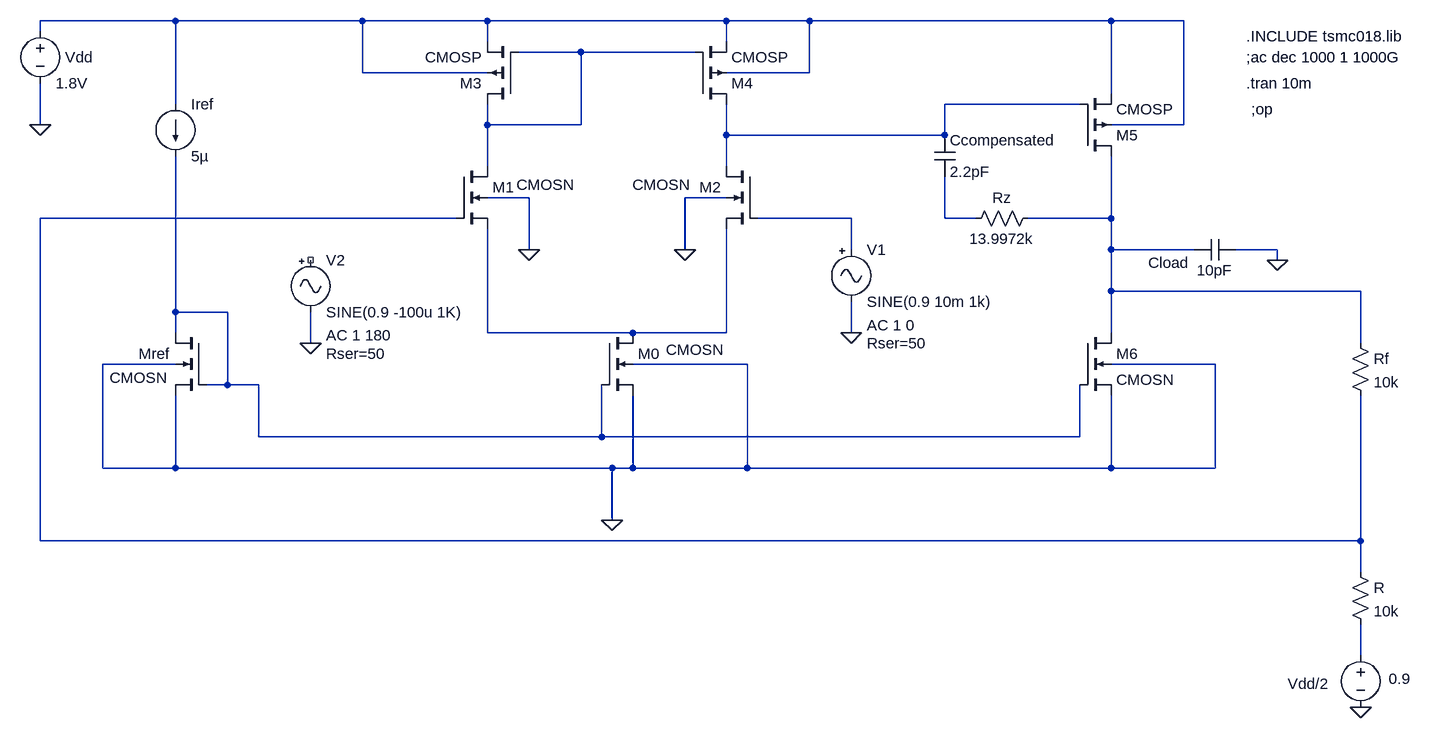
[diagram p0: schematic 2_STAGE_OTA_CLOSED_LOOP_ADITYATRIVED.asc]
2_STAGE_OTA_CLOSED_LOOP_ADITYATRIVED.asc, the LTspice schematic file:
Version 4
SHEET 1 1724 804
WIRE -416 -288 -624 -288
WIRE -128 -288 -416 -288
WIRE 64 -288 -128 -288
WIRE 432 -288 64 -288
WIRE 560 -288 432 -288
WIRE 1024 -288 560 -288
WIRE 1136 -288 1024 -288
WIRE -624 -272 -624 -288
WIRE 64 -256 64 -288
WIRE 432 -256 432 -288
WIRE 208 -240 112 -240
WIRE 384 -240 208 -240
WIRE -128 -208 -128 -288
WIRE 64 -208 -128 -208
WIRE 560 -208 560 -288
WIRE 560 -208 432 -208
WIRE 1024 -176 1024 -288
WIRE -416 -160 -416 -288
WIRE 928 -160 768 -160
WIRE 976 -160 928 -160
WIRE -624 -128 -624 -192
WIRE 64 -128 64 -160
WIRE 208 -128 208 -240
WIRE 208 -128 64 -128
WIRE 1136 -128 1136 -288
WIRE 1136 -128 1024 -128
WIRE 432 -112 432 -160
WIRE 768 -112 768 -160
WIRE 768 -112 432 -112
WIRE 64 -64 64 -128
WIRE 432 -64 432 -112
WIRE 128 -16 64 -16
WIRE 432 -16 368 -16
WIRE 1024 -16 1024 -80
WIRE -80 16 -624 16
WIRE 16 16 -80 16
WIRE 624 16 480 16
WIRE 768 16 768 -48
WIRE 816 16 768 16
WIRE 1024 16 1024 -16
WIRE 1024 16 896 16
WIRE 128 64 128 -16
WIRE 368 64 368 -16
WIRE 624 64 624 16
WIRE 1024 64 1024 16
WIRE 1152 64 1024 64
WIRE 1280 64 1216 64
WIRE 1280 80 1280 64
WIRE -416 112 -416 -80
WIRE 1024 128 1024 64
WIRE 1408 128 1024 128
WIRE -416 160 -416 112
WIRE -336 160 -416 160
WIRE -416 192 -416 160
WIRE 64 192 64 32
WIRE 240 192 64 192
WIRE 288 192 240 192
WIRE 432 192 432 32
WIRE 432 192 288 192
WIRE 624 192 624 144
WIRE 1024 192 1024 128
WIRE -208 208 -208 160
WIRE 1408 208 1408 128
WIRE -416 240 -528 240
WIRE 464 240 288 240
WIRE 1184 240 1024 240
WIRE -336 272 -336 160
WIRE -336 272 -368 272
WIRE -288 272 -336 272
WIRE -288 352 -288 272
WIRE 160 352 -288 352
WIRE 240 352 240 272
WIRE 240 352 160 352
WIRE 912 352 240 352
WIRE 976 352 976 272
WIRE 976 352 912 352
WIRE -528 400 -528 240
WIRE -416 400 -416 288
WIRE -416 400 -528 400
WIRE 256 400 -416 400
WIRE 288 400 288 288
WIRE 288 400 256 400
WIRE 464 400 464 240
WIRE 464 400 288 400
WIRE 1024 400 1024 288
WIRE 1024 400 464 400
WIRE 1184 400 1184 240
WIRE 1184 400 1024 400
WIRE 256 480 256 400
WIRE -624 512 -624 16
WIRE 1408 512 1408 288
WIRE 1408 512 -624 512
WIRE 1408 560 1408 512
WIRE 1408 688 1408 640
FLAG 256 480 0
FLAG -624 -128 0
FLAG 128 64 0
FLAG 368 64 0
FLAG 1408 768 0
FLAG 624 192 0
FLAG -208 208 0
FLAG 1280 80 0
DATAFLAG 432 -112 ""
DATAFLAG 240 192 ""
DATAFLAG 208 -240 ""
DATAFLAG 928 -160 ""
DATAFLAG 912 352 ""
DATAFLAG 160 352 ""
DATAFLAG -416 112 ""
DATAFLAG -80 16 ""
DATAFLAG 64 -128 ""
DATAFLAG 1024 -16 ""
SYMBOL cmosn 240 192 R0
WINDOW 3 99 26 Left 2
SYMATTR InstName M0
SYMATTR Value2 l=1u w=8.5u
SYMBOL cmosn 16 -64 R0
WINDOW 3 93 28 Left 2
SYMATTR InstName M1
SYMATTR Value2 l=1u w=9u
SYMBOL cmosp 112 -160 R180
SYMATTR InstName M3
SYMATTR Value2 l=1u w=1.12u
SYMBOL cmosn 480 -64 M0
WINDOW 3 103 28 Left 2
SYMATTR InstName M2
SYMATTR Value2 l=1u w=9u
SYMBOL cmosp 384 -160 M180
SYMATTR InstName M4
SYMATTR Value2 l=1u w=1.12u
SYMBOL cmosn -368 192 M0
WINDOW 3 60 69 Left 2
SYMATTR InstName Mref
SYMATTR Value2 l=1u w=2u
SYMBOL current -416 -160 R0
WINDOW 123 0 0 Left 2
WINDOW 39 0 0 Left 2
SYMATTR InstName Iref
SYMATTR Value 5µ
SYMBOL voltage -624 -288 R0
WINDOW 123 0 0 Left 2
WINDOW 39 0 0 Left 2
WINDOW 0 38 56 Left 2
SYMATTR InstName Vdd
SYMATTR Value 1.8V
SYMBOL cmosp 976 -80 M180
SYMATTR InstName M5
SYMATTR Value2 l=1u w=7.138u
SYMBOL cmosn 976 192 R0
SYMATTR InstName M6
SYMATTR Value2 l=1u w=25u
SYMBOL voltage 1408 672 R0
WINDOW 123 0 0 Left 2
WINDOW 39 0 0 Left 2
WINDOW 0 -112 60 Left 2
WINDOW 3 43 52 Left 2
SYMATTR InstName Vdd/2
SYMATTR Value 0.9
SYMBOL res 912 0 R90
WINDOW 0 0 56 VBottom 2
WINDOW 3 32 56 VTop 2
SYMATTR InstName Rz
SYMATTR Value 13.9972k
SYMBOL res 1392 192 R0
SYMATTR InstName Rf
SYMATTR Value 10k
SYMBOL res 1392 544 R0
SYMATTR InstName R
SYMATTR Value 10k
SYMBOL Misc\\signal 624 48 R0
WINDOW 123 24 132 Left 2
WINDOW 39 24 160 Left 2
SYMATTR InstName V1
SYMATTR Value SINE(0.9 10m 1k)
SYMATTR Value2 AC 1 0
SYMATTR SpiceLine Rser=50
SYMBOL cap 752 -112 R0
SYMATTR InstName Ccompensated
SYMATTR Value 2.2pF
SYMBOL Misc\\signal -208 64 R0
WINDOW 123 24 132 Left 2
WINDOW 39 24 160 Left 2
SYMATTR InstName V2
SYMATTR Value SINE(0.9 -100u 1K)
SYMATTR Value2 AC 1 180
SYMATTR SpiceLine Rser=50
SYMBOL cap 1216 48 R90
WINDOW 0 52 103 VBottom 2
WINDOW 3 32 32 VTop 2
SYMATTR InstName Cload
SYMATTR Value 10pF
TEXT 1232 -264 Left 2 !.INCLUDE tsmc018.lib
TEXT 1232 -192 Left 2 !.tran 10m
TEXT 1232 -232 Left 2 !;ac dec 1000 1 1000G
TEXT 1240 -152 Left 2 !;op

The netlist it stands for:
* 2_STAGE_OTA_CLOSED_LOOP_ADITYATRIVED.asc
M0 N009 N008 0 0 CMOSN l=1u w=8.5u
M1 N002 N005 N009 0 CMOSN l=1u w=9u
M3 N002 N002 N001 N001 CMOSP l=1u w=1.12u
M2 N003 N006 N009 0 CMOSN l=1u w=9u
M4 N003 N002 N001 N001 CMOSP l=1u w=1.12u
Mref N008 N008 0 0 CMOSN l=1u w=2u
Iref N001 N008 5µ
Vdd N001 0 1.8V
M5 N004 N003 N001 N001 CMOSP l=1u w=7.138u
M6 N004 N008 0 0 CMOSN l=1u w=25u
Vdd/2 N010 0 0.9
Rz N004 N007 13.9972k
Rf N004 N005 10k
R N005 N010 10k
V1 N006 0 SINE(0.9 10m 1k) AC 1 0 Rser=50
Ccompensated N003 N007 2.2pF
V2 NC_01 0 SINE(0.9 -100u 1K) AC 1 180 Rser=50
Cload 0 N004 10pF
.model NMOS NMOS
.model PMOS PMOS
.lib standard.mos
.INCLUDE tsmc018.lib
.tran 10m
;ac dec 1000 1 1000G
;op
.backanno
.end